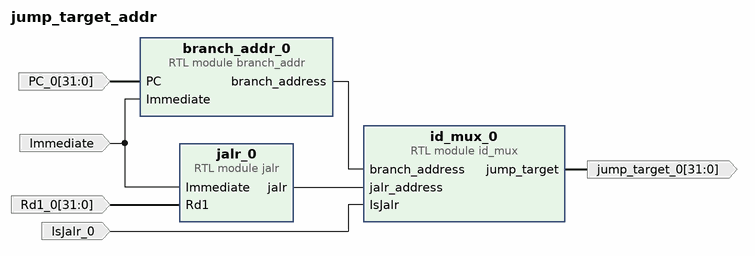
[diagram p0: block diagram of the top level]
# Vivado block design jump_target_addr, xc7z020clg484-1, Vivado 2019.2.1
create_bd_design jump_target_addr

create_bd_port -dir I -from 31 -to 0 PC_0
create_bd_port -dir I -from 31 -to 0 Rd1_0
create_bd_port -dir O -from 31 -to 0 jump_target_0
create_bd_port -dir I IsJalr_0
create_bd_port -dir I Immediate

create_bd_cell -type module -reference jalr jalr_0
create_bd_cell -type module -reference branch_addr branch_addr_0
create_bd_cell -type module -reference id_mux id_mux_0

# ---- connections ----

connect_bd_net [get_bd_pins jalr_0/jalr] [get_bd_pins id_mux_0/jalr_address]
connect_bd_net [get_bd_pins branch_addr_0/branch_address] [get_bd_pins id_mux_0/branch_address]
connect_bd_net -net PC_0_1 [get_bd_ports PC_0] [get_bd_pins branch_addr_0/PC]
connect_bd_net -net Rd1_0_1 [get_bd_ports Rd1_0] [get_bd_pins jalr_0/Rd1]
connect_bd_net [get_bd_pins id_mux_0/jump_target] [get_bd_ports jump_target_0]
connect_bd_net -net IsJalr_0_1 [get_bd_ports IsJalr_0] [get_bd_pins id_mux_0/IsJalr]
connect_bd_net [get_bd_ports Immediate] [get_bd_pins jalr_0/Immediate] [get_bd_pins branch_addr_0/Immediate]

validate_bd_design
save_bd_design
